# Altium schematic sheet eBox_Led.SchDoc
size 371 x 119 mm
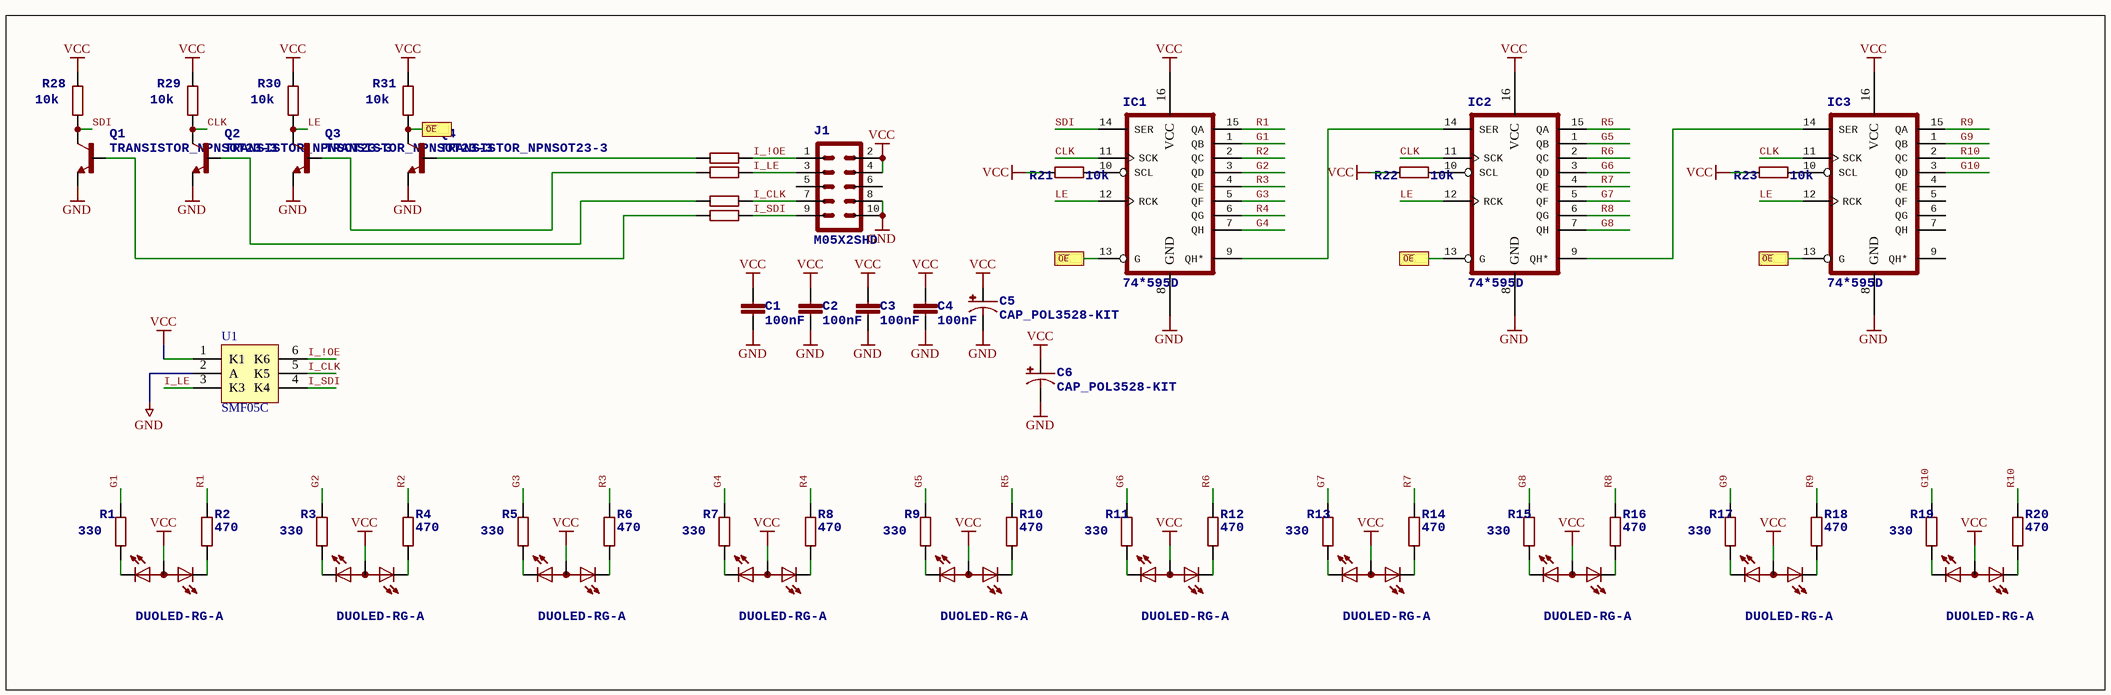
[diagram p0: eBox_Led.SchDoc]

## Parts
C1  100nF  [C 0603]
C2  100nF  [C 0603]
C3  100nF  [C 0603]
C4  100nF  [C 0603]
C5  CAP_POL3528-KIT  [CYL/D.250/LS.100]
C6  CAP_POL3528-KIT  [CYL/D.250/LS.100]
IC1  74*595D  [SOIC-16]
IC2  74*595D  [SOIC-16]
IC3  74*595D  [SOIC-16]
J1  M05X2SHD  [2X5-SHROUDED]
LD1  DUOLED-RG-A  [DUOLED-A-5MM]
LD2  DUOLED-RG-A  [DUOLED-A-5MM]
LD3  DUOLED-RG-A  [DUOLED-A-5MM]
LD4  DUOLED-RG-A  [DUOLED-A-5MM]
LD5  DUOLED-RG-A  [DUOLED-A-5MM]
LD6  DUOLED-RG-A  [DUOLED-A-5MM]
LD7  DUOLED-RG-A  [DUOLED-A-5MM]
LD8  DUOLED-RG-A  [DUOLED-A-5MM]
LD9  DUOLED-RG-A  [DUOLED-A-5MM]
LD10  DUOLED-RG-A  [DUOLED-A-5MM]
Q1  TRANSISTOR_NPNSOT23-3  [SOT23-3]
Q2  TRANSISTOR_NPNSOT23-3  [SOT23-3]
Q3  TRANSISTOR_NPNSOT23-3  [SOT23-3]
Q4  TRANSISTOR_NPNSOT23-3  [SOT23-3]
R1  330  [R 0603]
R2  470  [R 0603]
R3  330  [R 0603]
R4  470  [R 0603]
R5  330  [R 0603]
R6  470  [R 0603]
R7  330  [R 0603]
R8  470  [R 0603]
R9  330  [R 0603]
R10  470  [R 0603]
R11  330  [R 0603]
R12  470  [R 0603]
R13  330  [R 0603]
R14  470  [R 0603]
R15  330  [R 0603]
R16  470  [R 0603]
R17  330  [R 0603]
R18  470  [R 0603]
R19  330  [R 0603]
R20  470  [R 0603]
R21  10k  [R 0603]
R22  10k  [R 0603]
R23  10k  [R 0603]
R24  10k  [R 0603]  (value not drawn)
R25  10k  [R 0603]  (value not drawn)
R26  10k  [R 0603]  (value not drawn)
R27  10k  [R 0603]  (value not drawn)
R28  10k  [R 0603]
R29  10k  [R 0603]
R30  10k  [R 0603]
R31  10k  [R 0603]
U1  SMF05C  [SOT-363-6]

## Ports
~{OE}

## Nets
GND: C1.2 C2.2 C3.2 C4.2 C5.2(-) C6.2(-) IC1.8(GND) IC2.8(GND) IC3.8(GND) J1.8 J1.10 Q1.2(E) Q2.2(E) Q3.2(E) Q4.2(E) U1.2(A)
VCC: C1.1 C2.1 C3.1 C4.1 C5.1(+) C6.1(+) IC1.16(VCC) IC2.16(VCC) IC3.16(VCC) J1.2 J1.4 LD1.A LD2.A LD3.A LD4.A LD5.A LD6.A LD7.A LD8.A LD9.A LD10.A R21.2 R22.2 R23.2 R28.2 R29.2 R30.2 R31.2 U1.1(K1)
CLK: IC1.11(SCK) IC2.11(SCK) IC3.11(SCK) Q2.3(C) R29.1
G1: IC1.1(QB) R1.2
G2: IC1.3(QD) R3.2
G3: IC1.5(QF) R5.2
G4: IC1.7(QH) R7.2
G5: IC2.1(QB) R9.2
G6: IC2.3(QD) R11.2
G7: IC2.5(QF) R13.2
G8: IC2.7(QH) R15.2
G9: IC3.1(QB) R17.2
G10: IC3.3(QD) R19.2
I_!OE: J1.1 R24.1 U1.6(K6)
I_CLK: J1.7 R26.1 U1.5(K5)
I_LE: J1.3 R25.1 U1.3(K3)
I_SDI: J1.9 R27.1 U1.4(K4)
LE: IC1.12(RCK) IC2.12(RCK) IC3.12(RCK) Q3.3(C) R30.1
~{OE}: IC1.13(G) IC2.13(G) IC3.13(G) Q4.3(C) R31.1 ; port ~{OE}
R1: IC1.15(QA) R2.2
R2: IC1.2(QC) R4.2
R3: IC1.4(QE) R6.2
R4: IC1.6(QG) R8.2
R5: IC2.15(QA) R10.2
R6: IC2.2(QC) R12.2
R7: IC2.4(QE) R14.2
R8: IC2.6(QG) R16.2
R9: IC3.15(QA) R18.2
R10: IC3.2(QC) R20.2
SDI: IC1.14(SER) Q1.3(C) R28.1
NetIC1_9: IC1.9(QH*) IC2.14(SER)
NetIC1_10: IC1.10(SCL) R21.1
NetIC2_9: IC2.9(QH*) IC3.14(SER)
NetIC2_10: IC2.10(SCL) R22.1
NetIC3_10: IC3.10(SCL) R23.1
NetLD1_CR: LD1.CR R2.1
NetLD1_CX: LD1.CX(CG) R1.1
NetLD2_CR: LD2.CR R4.1
NetLD2_CX: LD2.CX(CG) R3.1
NetLD3_CR: LD3.CR R6.1
NetLD3_CX: LD3.CX(CG) R5.1
NetLD4_CR: LD4.CR R8.1
NetLD4_CX: LD4.CX(CG) R7.1
NetLD5_CR: LD5.CR R10.1
NetLD5_CX: LD5.CX(CG) R9.1
NetLD6_CR: LD6.CR R12.1
NetLD6_CX: LD6.CX(CG) R11.1
NetLD7_CR: LD7.CR R14.1
NetLD7_CX: LD7.CX(CG) R13.1
NetLD8_CR: LD8.CR R16.1
NetLD8_CX: LD8.CX(CG) R15.1
NetLD9_CR: LD9.CR R18.1
NetLD9_CX: LD9.CX(CG) R17.1
NetLD10_CR: LD10.CR R20.1
NetLD10_CX: LD10.CX(CG) R19.1
NetQ1_1: Q1.1(B) R27.2
NetQ2_1: Q2.1(B) R26.2
NetQ3_1: Q3.1(B) R25.2
NetQ4_1: Q4.1(B) R24.2

Not connected (* = marked no-connect by the designer): IC3 4(QE) 5(QF) 6(QG) 7(QH) 9(QH*); J1 5 6

## Library data of the parts
C1-C4 = CAP0603-CAP: CapacitorStandard 0603 ceramic capacitor, and 0.1" leaded capacitor.
C5 C6 = CAP_POL3528-KIT: Capacitor PolarizedThese are standard SMD and PTH capacitors. Normally 10uF, 47uF, and 100uF in electrolytic and tantalum varieties. Always verify the external diameter of the through hole cap, it varies with capacity, voltage, and manufacturer. The EIA devices should be standard.
IC1-IC3 = 74*595D: 8-bit SHIFT REGISTER, output latch
J1 = M05X2SHD: Header 5x2Standard 10-pin dual row 0.1" header. Commonly used with AVR-ISP. Use with Spark Fun Electronics SKU: PRT-00778
LD1-LD10 = DUOLED-RG-A: DUO LED   2 colors (red/green), 5 mm, round, common Anode www.ligitek.com or other producers.
Q1-Q4 = TRANSISTOR_NPNSOT23-3: Generic NPN BJT   MMBT2222A - TRANS-08049 (SOT-23, 1A 40V) MPSA42 - TRANS-09116 (SOT-23, 500mA 300V) MMBT5088LT1G - TRANS-11160 (SOT-23, 50 mA 30V)          BC547 -     COM-08928    (TO-92 45V 100mA) (1.Collector 2.Base 3.Emitter)             2N3904 -     COM-00521    (TO-92 40V 200mA) (1.Emitter 2.Base 3.Collector)             P2N2222A -     COM-12852    (TO-92 40V 600mA) (1.Collector 2.Base 3.Emitter); PROD_ID: TRANS-08049
R1-R31 = R-EU_R0603: RESISTOR, European symbol
U1 = SMF05C: 5-Line Transient Voltage Suppressor Array